# EAGLE schematic nightLight (EAGLE 6.1)
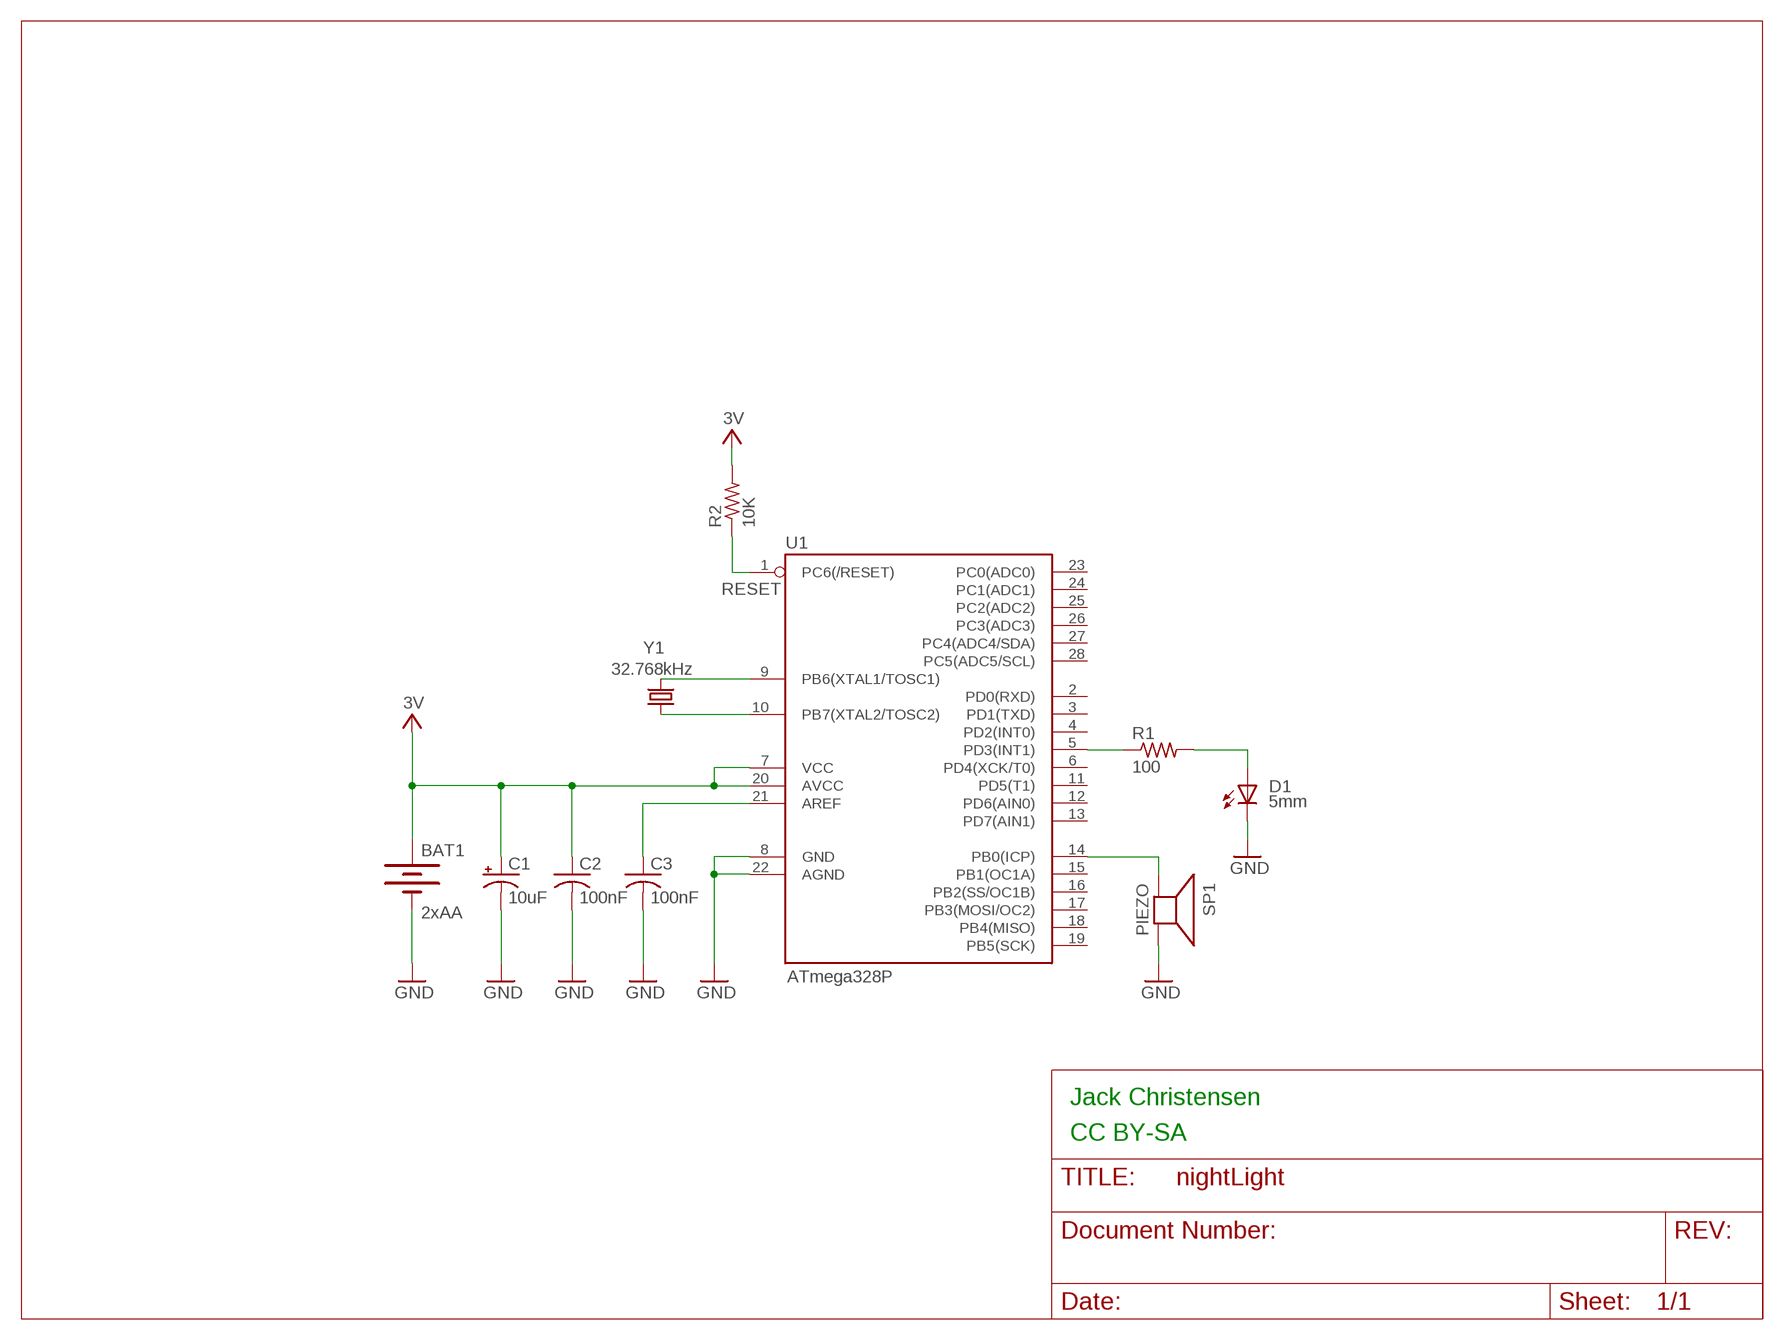
[diagram p0: schematic, sheet 1]

## Parts
BAT1  2xAA  BATTERYAA  [BATTERY-AA]
C1  10uF  CPOL-USE5-4  [E5-4]
C2  100nF  C-US025-025X050  [C025-025X050]
C3  100nF  C-US025-025X050  [C025-025X050]
D1  5mm  LED5MM  [LED5MM]
R1  100  R-US_0204/6  [0204/6]
R2  10K  R-US_0204/6  [0204/6]
SP1  PIEZO  SPEAKER/AL11P  [AL11P]
U1  ATmega328P  AVR-MEGA8-PPTH  [DIL28-3]
Y1  32.768kHz  CRYSTALTC38H  [TC38H]

## Nets
GND: BAT1.GND@1(-) C1.- C2.2 C3.2 D1.K(C) SP1.- U1.8(GND) U1.22(AGND)
N$1: R1.1 U1.5(PD3(INT1))
N$2: D1.A R1.2
N$3: U1.10(PB7(XTAL2/TOSC2)) Y1.1
N$4: U1.9(PB6(XTAL1/TOSC1)) Y1.2
N$5: SP1.+ U1.14(PB0(ICP))
N$10: C3.1 U1.21(AREF)
RESET: R2.1 U1.1(PC6(/RESET))
VCC: BAT1.PWR@1(+) C1.+ C2.1 R2.2 U1.7(VCC) U1.20(AVCC) ; supply symbol labelled 3V
Unconnected: U1.2(PD0(RXD)) U1.3(PD1(TXD)) U1.4(PD2(INT0)) U1.6(PD4(XCK/T0)) U1.11(PD5(T1)) U1.12(PD6(AIN0)) U1.13(PD7(AIN1)) U1.15(PB1(OC1A)) U1.16(PB2(SS/OC1B)) U1.17(PB3(MOSI/OC2)) U1.18(PB4(MISO)) U1.19(PB5(SCK)) U1.23(PC0(ADC0)) U1.24(PC1(ADC1)) U1.25(PC2(ADC2)) U1.26(PC3(ADC3)) U1.27(PC4(ADC4/SDA)) U1.28(PC5(ADC5/SCL))

## Notes on the sheet
- Jack Christensen
- CC BY-SA

## Library data of the parts
BAT1 = SparkFun:BATTERY: Battery Holders Various common sizes : AA, AAA, 20mm coin cell and 12mm coin cell.
C1 = _jc:CPOL-US: POLARIZED CAPACITOR, American symbol
C2 C3 = _jc:C-US: CAPACITOR, American symbol
D1 = _jc:LED: LED OSRAM: - CHIPLED LG R971, LG N971, LY N971, LG Q971, LY Q971, LO R971, LY R971 LH N974, LH R974 LS Q976, LO Q976, LY Q976 LO Q996 - Hyper CHIPLED LW Q18S LB Q993, LB Q99A, LB R99A - SideLED LS A670, LO A670, LY A670, LG A670, LP A670 LB A673, LV A673, LT A673, LW A673 LH A674 LY A675 LS A676, LA A676, LO A676, LY A676, LW A676 LS A679, LY A679, LG A679 - Hyper Micro SIDELED® LS Y876, LA Y876, LO Y876, LY Y876 LT Y87S - SmartLED LW L88C, LW L88S LB L89C, LB L89S, LG L890 LS L89K, LO L89K, LY L89K LS L896, LA L896, LO L896, LY L896 - TOPLED LS T670, LO T670, LY T670, LG T670, LP T670 LSG T670, LSP T670, LSY T670, LOP T670, LYG T670 LG T671, LOG T671, LSG T671 LB T673, LV T673, LT T673, LW T673 LH T674 LS T676, LA T676, LO T676, LY T676, LB T676, LH T676, LSB T676, LW T676 LB T67C, LV T67C, LT T67C, LS T67K, LO T67K, LY T67K, LW E67C LS E67B, LA E67B, LO E67B, LY E67B, LB E67C, LV E67C, LT E67C LW T67C LS T679, LY T679, LG T679 LS T770, LO T770, LY T770, LG T770, LP T770 LB T773, LV T773, LT T773, LW T773 LH T774 LS E675, LA E675, LY E675, LS T675 LS T776, LA T776, LO T776, LY T776, LB T776 LHGB T686 LT T68C, LB T68C - Hyper Mini TOPLED® LB M676 - Mini TOPLED Santana® LG M470 LS M47K, LO M47K, LY M47K Source: http://www.osram.convergy.de/
R1 R2 = _jc:R-US_: RESISTOR, American symbol
SP1 = adafruit:SPEAKER: SPEAKER Source: Buerklin Added PS12 (for part # PS1240 piezo) http://www.ladyada.net/library/pcb/eaglelibrary.html
U1 = _jc:AVR-MEGA8-P: MICROCONTROLLER 8 Kbytes FLASH 1 kbytes SRAM 512 bytes EEPROM USART 4-channel 10 bit ADC 2-channel 8 bit ADC
Y1 = crystal:CRYSTAL: CRYSTAL; OC_FARNELL: unknown; OC_NEWARK: unknown